# Altium schematic sheet adc.SchDoc: TMS320F28388 ADC/DAC
size A3; SheetNumber: 5; SheetTotal: 17
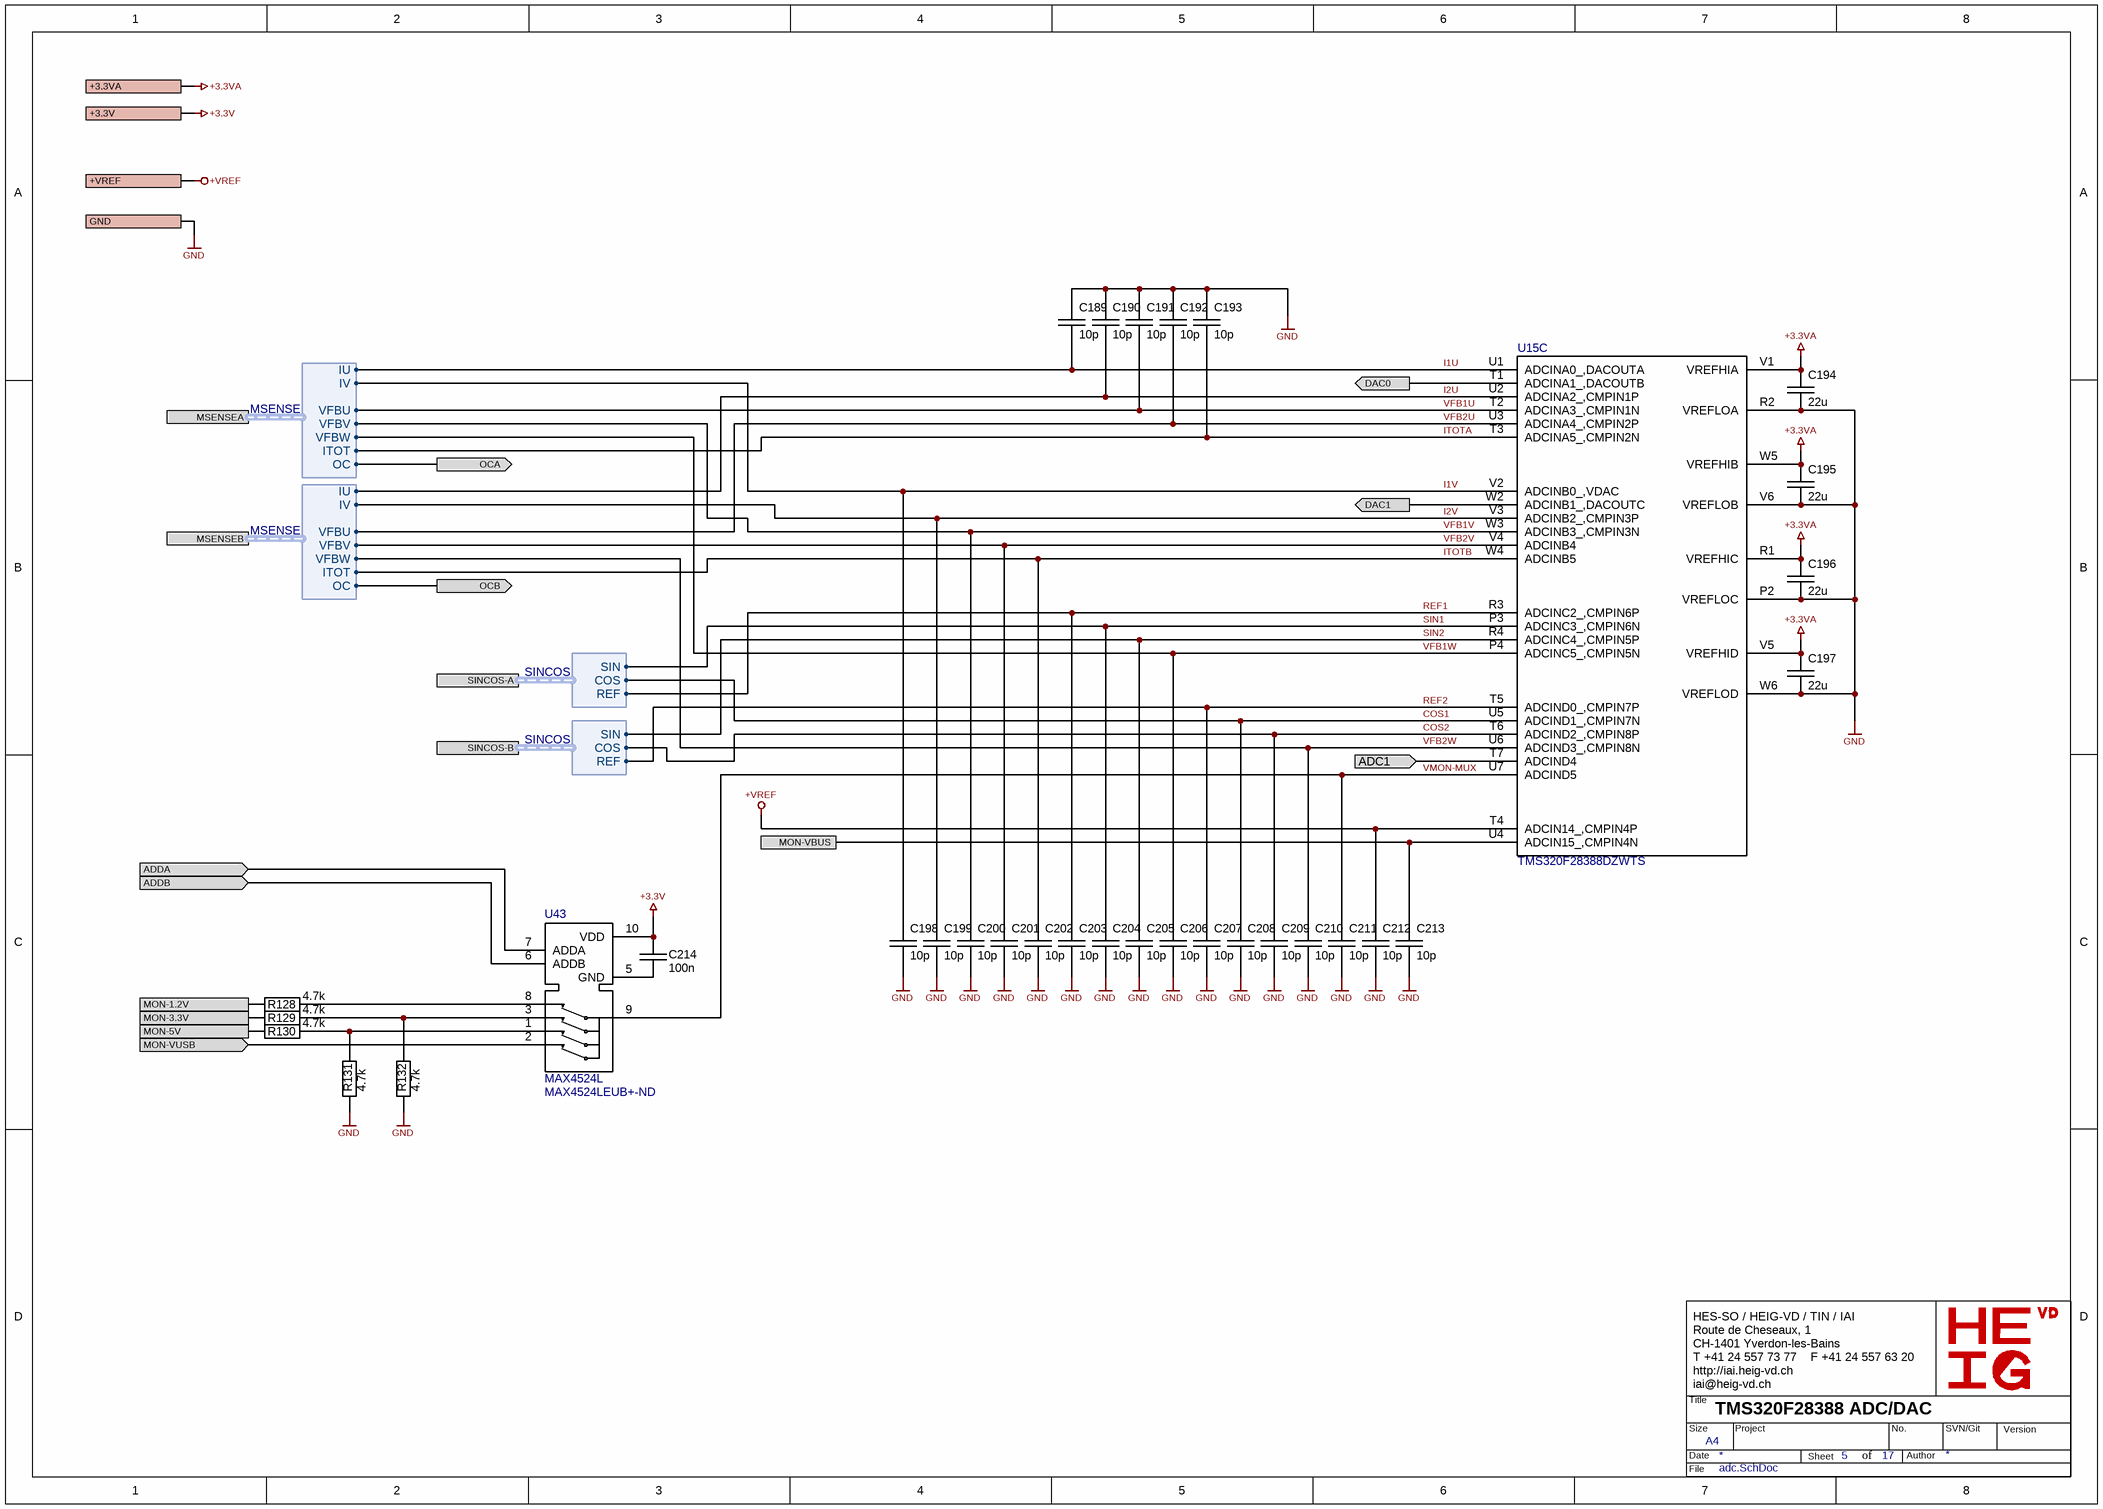
[diagram p0: adc.SchDoc]

## Parts
C189  10p  [SM/C0201]
C190  10p  [SM/C0201]
C191  10p  [SM/C0201]
C192  10p  [SM/C0201]
C193  10p  [SM/C0201]
C194  22u  [SM/C0402]
C195  22u  [SM/C0402]
C196  22u  [SM/C0402]
C197  22u  [SM/C0402]
C198  10p  [SM/C0201]
C199  10p  [SM/C0201]
C200  10p  [SM/C0201]
C201  10p  [SM/C0201]
C202  10p  [SM/C0201]
C203  10p  [SM/C0201]
C204  10p  [SM/C0201]
C205  10p  [SM/C0201]
C206  10p  [SM/C0201]
C207  10p  [SM/C0201]
C208  10p  [SM/C0201]
C209  10p  [SM/C0201]
C210  10p  [SM/C0201]
C211  10p  [SM/C0201]
C212  10p  [SM/C0201]
C213  10p  [SM/C0201]
C214  100n  [SM/C0402]
R128  4.7k  [SM/R0402]
R129  4.7k  [SM/R0402]
R130  4.7k  [SM/R0402]
R131  4.7k  [SM/R0402]
R132  4.7k  [SM/R0402]
U15  TMS320F28388DZWTS  [BGA337C80P19X19_1600X1600X140]  (part C of 4)
U43  MAX4524L  Supplier Part Number 1: MAX4524LEUB+-ND  [MSOP10]

## Ports
+3.3V, +3.3VA, +VREF, ADC1 (in), ADDA (in), ADDB (in), DAC0 (out), DAC1 (out), GND, MON-1.2V, MON-3.3V, MON-5V, MON-VBUS, MON-VUSB (in), MSENSEA (harness MSENSE), MSENSEB (harness MSENSE), OCA (out), OCB (out), SINCOS-A (harness SINCOS), SINCOS-B (harness SINCOS)

## Harnesses
MSENSE: IU, IV, VFBU, VFBV, ITOT, OC, VFBW
SINCOS: SIN, COS, REF

## Nets
+3.3V: C214.1 U43.10(VDD) ; port +3.3V
+3.3VA: C194.1 C195.1 C196.1 C197.1 U15.R1(VREFHIC) U15.V1(VREFHIA) U15.V5(VREFHID) U15.W5(VREFHIB) ; port +3.3VA
+VREF: C212.1 U15.T4(ADCIN14_,CMPIN4P) ; port +VREF
GND: C189.1 C190.1 C191.1 C192.1 C193.1 C194.2 C195.2 C196.2 C197.2 C198.2 C199.2 C200.2 C201.2 C202.2 C203.2 C204.2 C205.2 C206.2 C207.2 C208.2 C209.2 C210.2 C211.2 C212.2 C213.2 R131.2 R132.2 U15.P2(VREFLOC) U15.R2(VREFLOA) U15.V6(VREFLOB) U15.W6(VREFLOD) ; port GND
ADC1: U15.T7(ADCIND4) ; port ADC1
ADDA: U43.7(ADDA) ; port ADDA
ADDB: U43.6(ADDB) ; port ADDB
COS1: C208.1 U15.U5(ADCIND1_,CMPIN7N) ; port SINCOS-A.COS
COS2: C209.1 U15.T6(ADCIND2_,CMPIN8P) ; port SINCOS-B.COS
DAC0: U15.T1(ADCINA1_,DACOUTB) ; port DAC0
DAC1: U15.W2(ADCINB1_,DACOUTC) ; port DAC1
I1U: C189.2 U15.U1(ADCINA0_,DACOUTA) ; port MSENSEA.IU
I1V: C198.1 U15.V2(ADCINB0_,VDAC) ; port MSENSEA.IV
I2U: C190.2 U15.U2(ADCINA2_,CMPIN1P) ; port MSENSEB.IU
I2V: C199.1 U15.V3(ADCINB2_,CMPIN3P) ; port MSENSEB.IV
ITOTA: C193.2 U15.T3(ADCINA5_,CMPIN2N) ; port MSENSEA.ITOT
ITOTB: C202.1 U15.W4(ADCINB5) ; port MSENSEB.ITOT
MON-1.2V: R128.1 ; port MON-1.2V
MON-3.3V: R129.1 ; port MON-3.3V
MON-5V: R130.1 ; port MON-5V
MON-VBUS: C213.1 U15.U4(ADCIN15_,CMPIN4N) ; port MON-VBUS
MON-VUSB: U43.2(NO3) ; port MON-VUSB
OCA: port OCA, port MSENSEA.OC
OCB: port OCB, port MSENSEB.OC
REF1: C203.1 U15.R3(ADCINC2_,CMPIN6P) ; port SINCOS-A.REF
REF2: C207.1 U15.T5(ADCIND0_,CMPIN7P) ; port SINCOS-B.REF
SIN1: C204.1 U15.P3(ADCINC3_,CMPIN6N) ; port SINCOS-A.SIN
SIN2: C205.1 U15.R4(ADCINC4_,CMPIN5P) ; port SINCOS-B.SIN
VFB1U: C191.2 U15.T2(ADCINA3_,CMPIN1N) ; port MSENSEA.VFBU
VFB1V: C200.1 U15.W3(ADCINB3_,CMPIN3N) ; port MSENSEA.VFBV
VFB1W: C206.1 U15.P4(ADCINC5_,CMPIN5N) ; port MSENSEA.VFBW
VFB2U: C192.2 U15.U3(ADCINA4_,CMPIN2P) ; port MSENSEB.VFBU
VFB2V: C201.1 U15.V4(ADCINB4) ; port MSENSEB.VFBV
VFB2W: C210.1 U15.U6(ADCIND3_,CMPIN8N) ; port MSENSEB.VFBW
VMON-MUX: C211.1 U15.U7(ADCIND5) U43.9(COM)
NetC214_2: C214.2 U43.5(GND)
NetR128_2: R128.2 U43.8(NO0)
NetR129_2: R129.2 R132.1 U43.3(NO1)
NetR130_2: R130.2 R131.1 U43.1(NO2)

## Notes on the sheet
- HES-SO / HEIG-VD / TIN / IAI
  Route de Cheseaux, 1
  CH-1401 Yverdon-les-Bains
  T +41 24 557 73 77    F +41 24 557 63 20
  http://iai.heig-vd.ch
  iai@heig-vd.ch
- Title
- Size
- Date
- A4
- Project
- Sheet
- of
- No.
- Author
- SVN/Git
- Version
- File

## Library data of the parts
C189-C193 C198-C213 = C: Chip Capacitor; Voltage: 16V; Dielectric: X7R; Supplier 1: Digi-Key; Supplier Part Number 1: 490-8607-1-ND; Value: 10p
C194-C197 = C: Chip Capacitor; Voltage: 6.3V; Dielectric: X5R; Supplier 1: Digi-Key; Supplier Part Number 1: 478-9839-1-ND; Value: 22u
C214 = C: 0.1 µF ±10% 25V Ceramic Capacitor X5R 0402 (1005 Metric); Dielectric: X5R; Supplier 1: Digi-Key; Supplier Part Number 1: 1276-1043-1-ND; Value: 100n; Voltage: 25V
R128-R132 = R: 4.7 kOhms ±5% 0.063W, 1/16W Chip Resistor 0402 (1005 Metric) Moisture Resistant Thick Film; Supplier 1: Digi-Key; Supplier Part Number 1: 311-4.7KJRCT-ND; Value: 4.7k
U15 = TMS320F28388DZWTS: Integrated Circuit; Datasheet Link: http://www.ti.com/lit/ds/symlink/tms320f28388d.pdf; Height: 1.4mm; Supplier 1: Mouser; Supplier Part Number 1: 595-F28388DZWTS
U43 = MAX4524L: 1 Circuit IC Switch 4:1 80Ohm 10-uMAX/uSOP / IC MUX/SW ANLG CMOS LV 10UMAX; Supplier 1: Digi-Key